# Altium schematic sheet NT3H2111W0FHKH.schdoc
size 127 x 101 mm
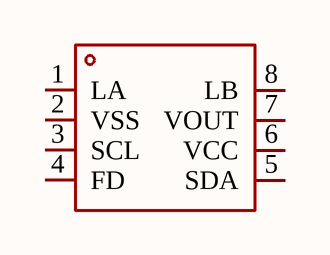
[diagram p0: NT3H2111W0FHKH.schdoc]

## Parts
U?  13.56MHz  [XQFN-8_L1.6-W1.6-P0.50-BL_NT3H2111W0FHKH]  (value not drawn)

## Nets

Not connected (* = marked no-connect by the designer): U? 1(LA) 2(VSS) 3(SCL) 4(FD) 5(SDA) 6(VCC) 7(VOUT) 8(LB)

## Library data of the parts
U? = NT3H2111W0FHKH: Manufacturer: NXP(恩智浦); Add into BOM: yes; agreement: ISO 14443; interface type: I2C; mains input: 3.3V; Symbol: NT3H2111W0FHKH; Device: NT3H2111W0FHKH; LCSC Part Name: NT3H2111W0FHKH; Supplier Part: C710403; Manufacturer Part: NT3H2111W0FHKH; Supplier Footprint: XQFN-8(1.6x1.6); JLCPCB Part Class: Extended Part; Datasheet: https://www.nxp.com/docs/en/data-sheet/NT3H2111_2211.pdf; Supplier: LCSC; Convert to PCB: yes; Value: 13.56MHz